# Altium schematic sheet Power_18.SchDoc
size A0
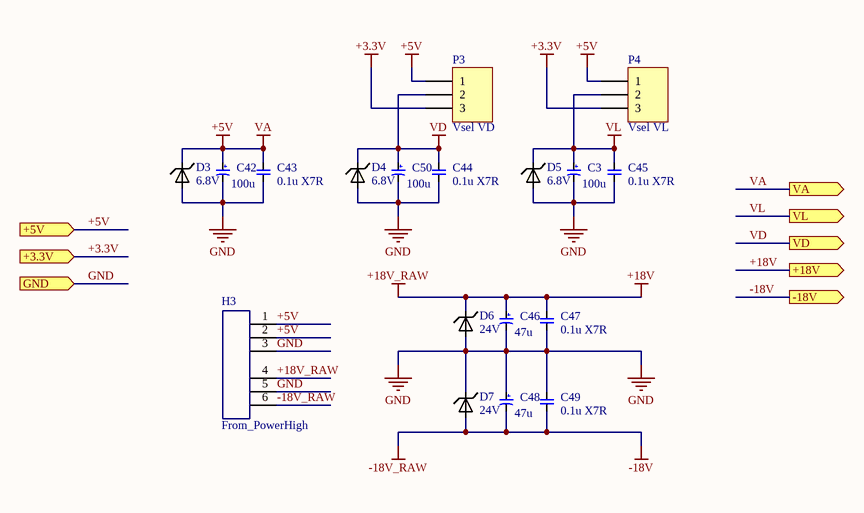
[diagram p0: Power_18.SchDoc]

## Parts
C3  100u  [cap 4x5.4]
C42  100u  [cap 4x5.4]
C43  0.1u X7R  [0805_cap]
C44  0.1u X7R  [0805_cap]
C45  0.1u X7R  [0805_cap]
C46  47u  [cap 4x5.4]
C47  0.1u X7R  [0805_cap]
C48  47u  [cap 4x5.4]
C49  0.1u X7R  [0805_cap]
C50  100u  [cap 4x5.4]
D3  6.8V  [SOD-80]
D4  6.8V  [SOD-80]
D5  6.8V  [SOD-80]
D6  24V  [SOD-80]
D7  24V  [SOD-80]
H3  From_PowerHigh  [header-6_male]
P3  Vsel VD  [HDR1X3]
P4  Vsel VL  [HDR1X3]

## Ports
+3.3V (in), +5V (in), +18V (out), -18V (out), GND (in), VA (out), VD (out), VL (out)

## Nets
+3.3V: P3.3 P4.3 ; port +3.3V
+5V: C42.1 C43.2 D3.C H3.1 H3.2 P3.1 P4.1 ; port +5V, port VA  [also labelled VA]
+18V: C46.1 C47.2 D6.C H3.4 ; port +18V  [also labelled +18V_RAW]
-18V: C48.2 C49.1 D7.A H3.6 ; port -18V  [also labelled -18V_RAW]
GND: C3.2 C42.2 C43.1 C44.1 C45.1 C46.2 C47.1 C48.1 C49.2 C50.2 D3.A D4.A D5.A D6.A D7.C H3.3 H3.5 ; port GND
VD: C44.2 C50.1 D4.C P3.2 ; port VD
VL: C3.1 C45.2 D5.C P4.2 ; port VL

## Library data of the parts
C3 C42 C46 C48 C50 = Cap_electrolytic
C43-C45 C47 C49 = Cap
D3-D7 = Stabilitron
H3 = arduino_header_6
P3 P4 = Header 3: Header, 3-Pin; LatestRevisionDate: 17-Jul-2002; LatestRevisionNote: Re-released for DXP Platform.; Publisher: Altium Limited